# EAGLE schematic PCA9548A (EAGLE 6.4)
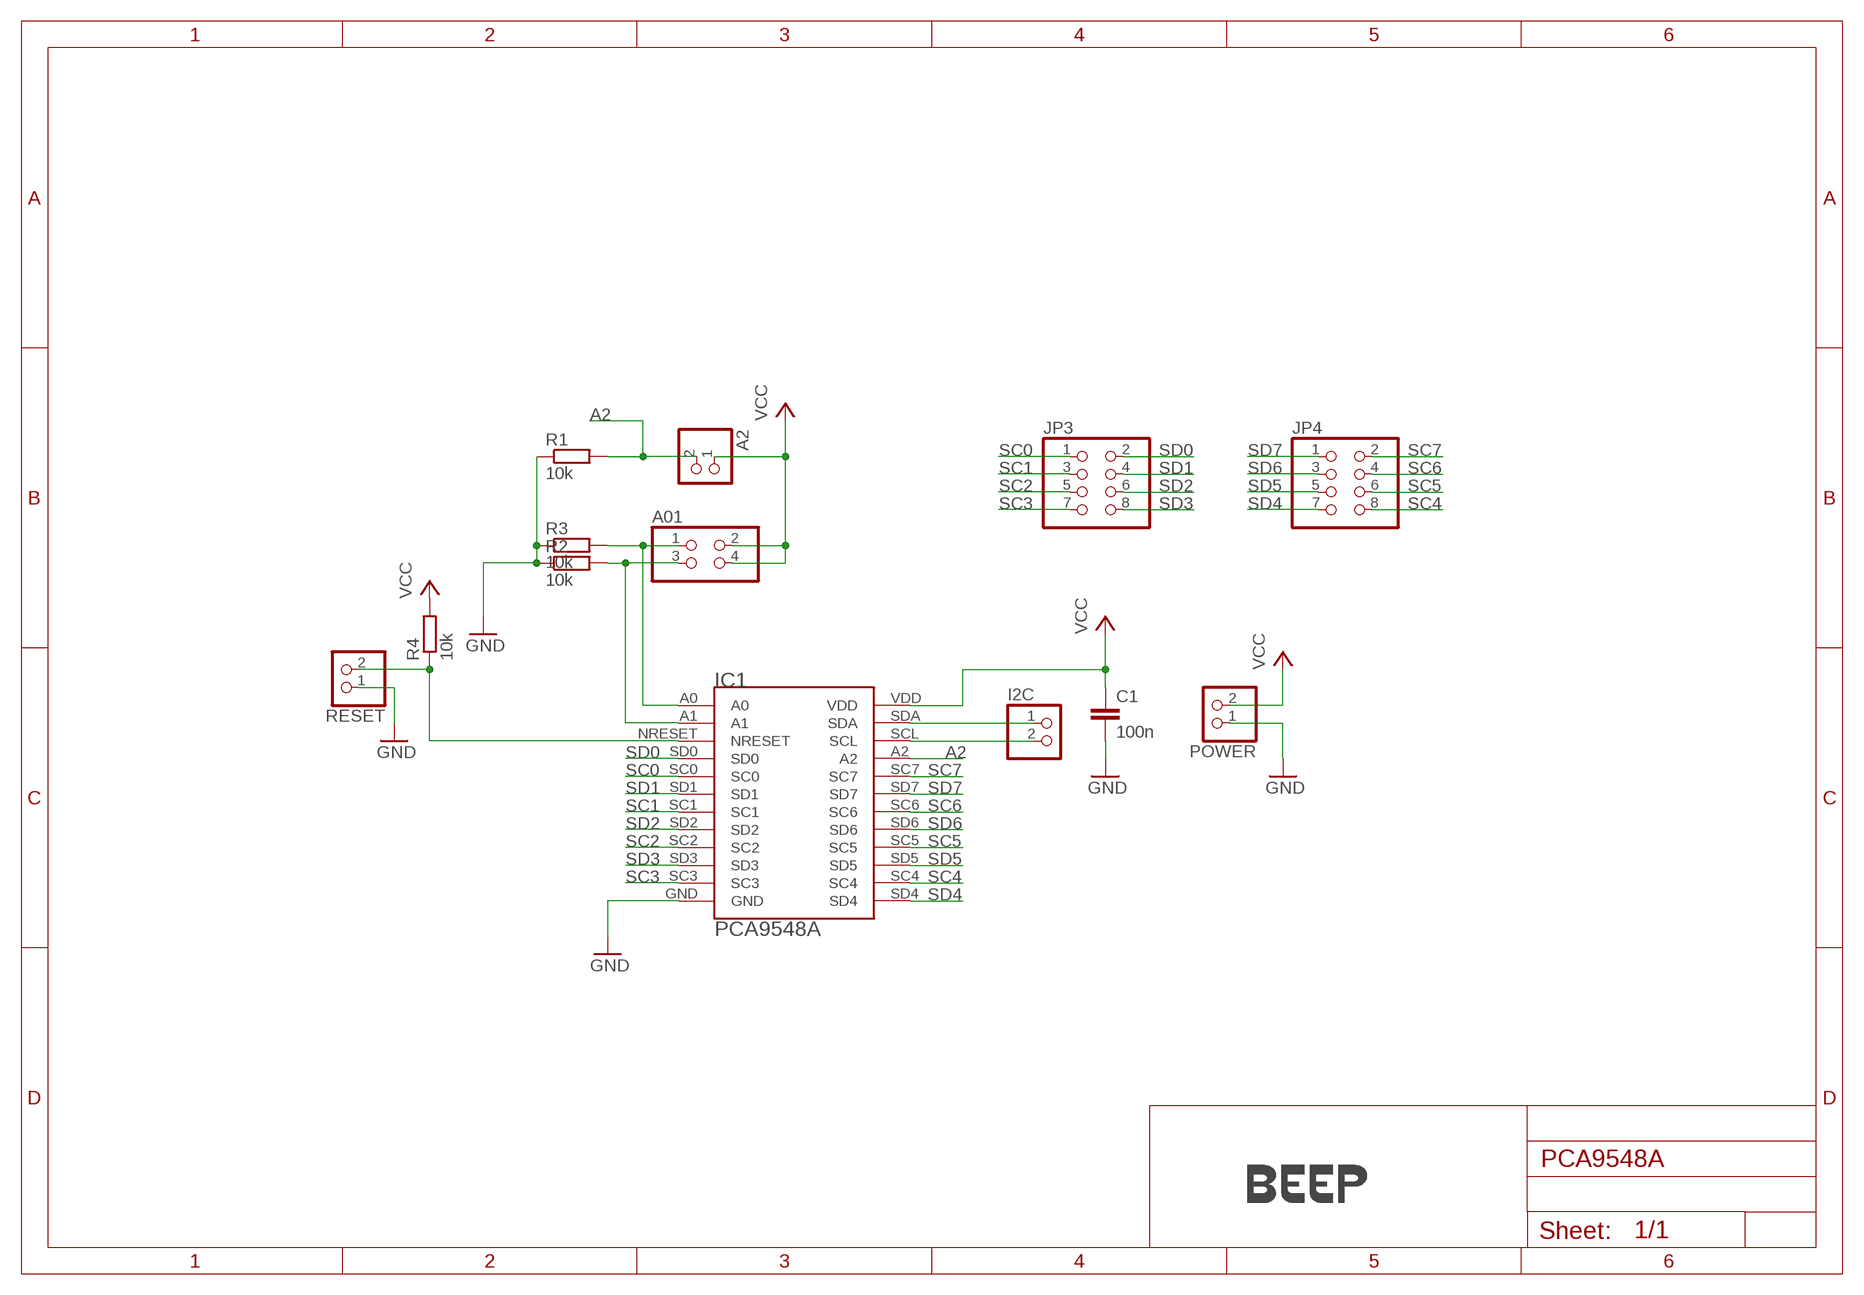
[diagram p0: schematic, sheet 1]

## Parts
A01  PINHD-2X2  [2X02]
A2  PINHD-1X2  [1X02]
C1  100n  C-EUC0805  [C0805]
I2C  PINHD-1X2  [1X02]
IC1  PCA9548A  [TSSOP24]
JP3  PINHD-2X4  [2X04]
JP4  PINHD-2X4  [2X04]
POWER  PINHD-1X2  [1X02]
R1  10k  R-EU_0207/7  [0207/7]
R2  10k  R-EU_0207/7  [0207/7]
R3  10k  R-EU_0207/7  [0207/7]
R4  10k  R-EU_M0805  [M0805]
RESET  PINHD-1X2  [1X02]
U$1  LOGO-COPPER4  [COPPER4]

## Nets
A2: A2.2 IC1.A2 R1.2
GND: C1.2 IC1.GND POWER.1 R1.1 R2.1 R3.1 RESET.1
I"C: I2C.1 IC1.SDA
N$3: IC1.NRESET R4.1 RESET.2
N$4: A01.1 IC1.A0 R3.2
N$5: I2C.2 IC1.SCL
N$6: A01.3 IC1.A1 R2.2
SC0: IC1.SC0 JP3.1
SC1: IC1.SC1 JP3.3
SC2: IC1.SC2 JP3.5
SC3: IC1.SC3 JP3.7
SC4: IC1.SC4 JP4.8
SC5: IC1.SC5 JP4.6
SC6: IC1.SC6 JP4.4
SC7: IC1.SC7 JP4.2
SD0: IC1.SD0 JP3.2
SD1: IC1.SD1 JP3.4
SD2: IC1.SD2 JP3.6
SD3: IC1.SD3 JP3.8
SD4: IC1.SD4 JP4.7
SD5: IC1.SD5 JP4.5
SD6: IC1.SD6 JP4.3
SD7: IC1.SD7 JP4.1
VCC: A01.2 A01.4 A2.1 C1.1 IC1.VDD POWER.2 R4.2

## Library data of the parts
A01 = pinhead:PINHD-2X2: PIN HEADER
A2 I2C POWER RESET = pinhead:PINHD-1X2: PIN HEADER
C1 = rcl:C-EU: CAPACITOR, European symbol
IC1 = BEEP:PCA9548A
JP3 JP4 = pinhead:PINHD-2X4: PIN HEADER
R1-R4 = rcl:R-EU_: RESISTOR, European symbol
U$1 = Branding:LOGO-COPPER